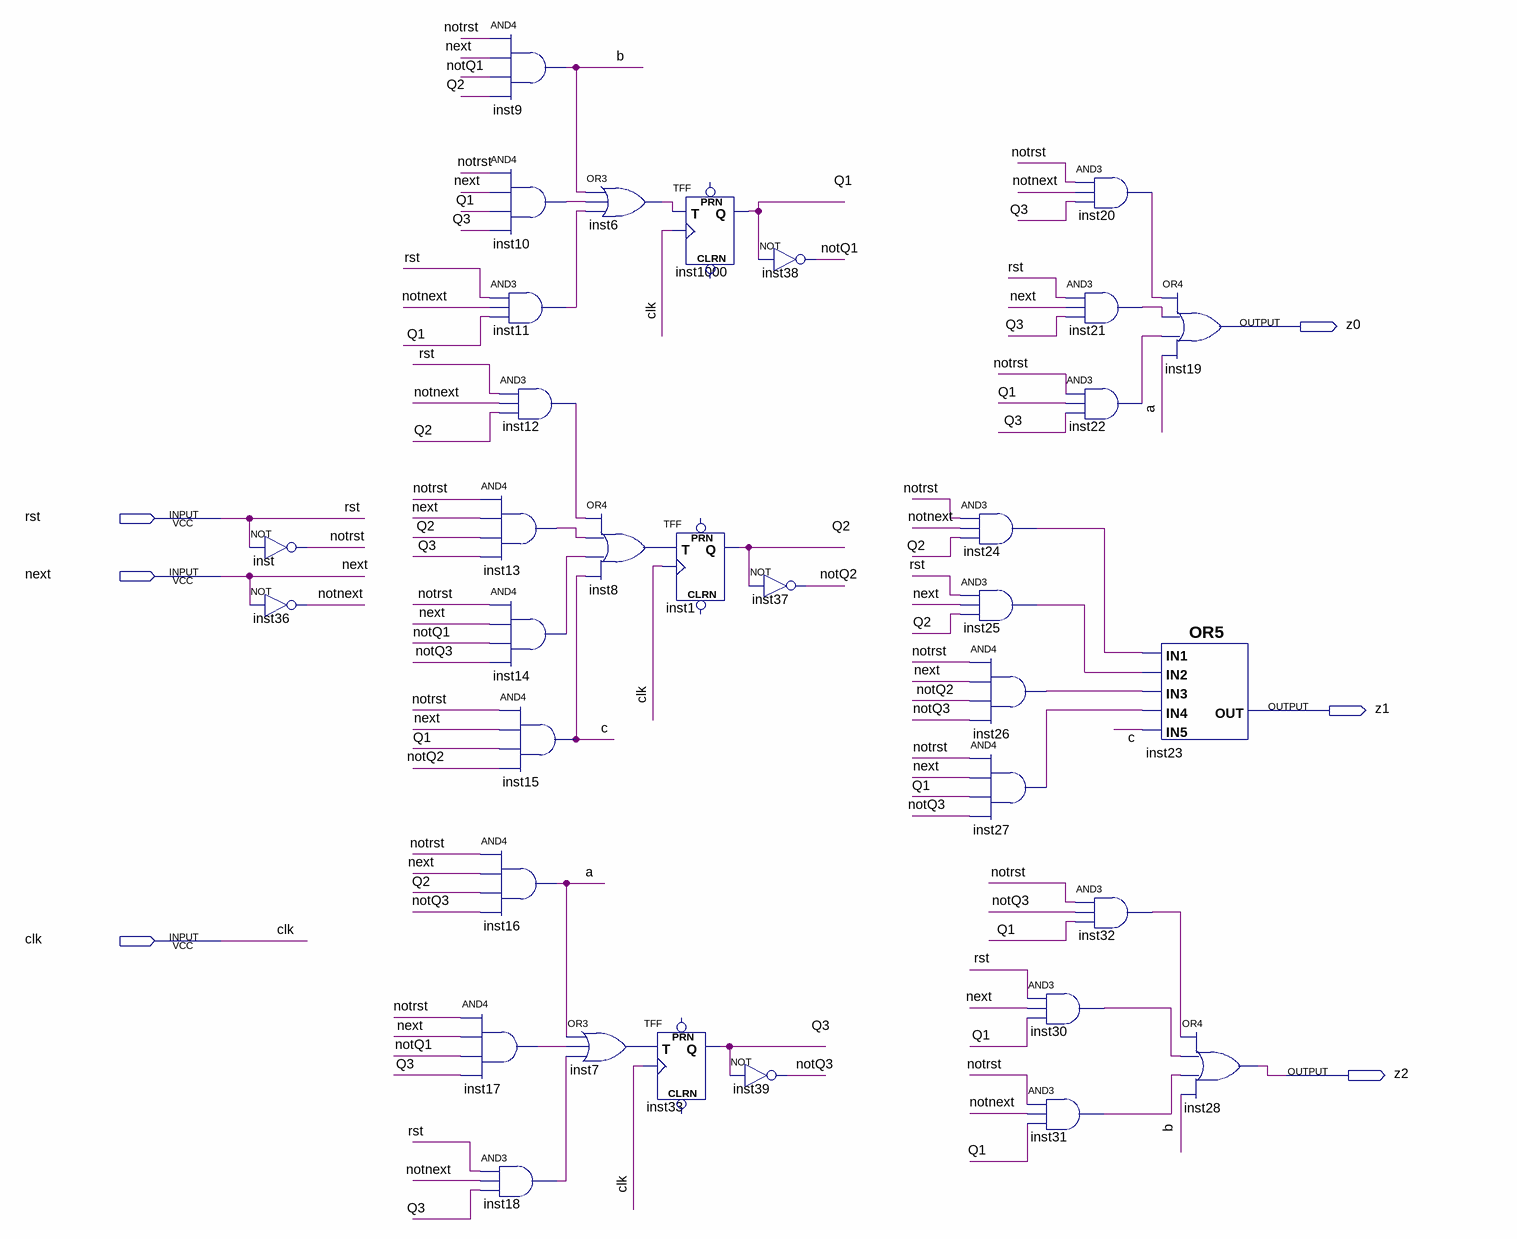
[diagram p0: schematic sheet]
// Quartus schematic PRandom07.bdf as structural Verilog: 34 symbols, 6 pins
module PRandom07 (
  input  rst,
  input  next,
  input  clk,
  output z0,
  output z1,
  output z2
);

  wire a, b, c, inst6_out, inst7_out, inst8_out, inst10_out, inst11_out, inst12_out, inst13_out, inst14_out,
       inst17_out, inst18_out, inst20_out, inst21_out, inst22_out, inst24_out, inst25_out, inst26_out,
       inst27_out, inst30_out, inst31_out, inst32_out, notnext, notQ1, notQ2, notQ3, notrst, Q1, Q2, Q3;

  not inst (notrst, rst);
  not inst36 (notnext, next);
  and inst9 (b, notrst, next, notQ1, Q2);
  and inst10 (inst10_out, notrst, next, Q1, Q3);
  and inst11 (inst11_out, rst, notnext, Q1);
  and inst12 (inst12_out, rst, notnext, Q2);
  and inst13 (inst13_out, notrst, next, Q2, Q3);
  and inst14 (inst14_out, notrst, next, notQ1, notQ3);
  and inst15 (c, notrst, next, Q1, notQ2);
  and inst16 (a, notrst, next, Q2, notQ3);
  and inst17 (inst17_out, notrst, next, notQ1, Q3);
  and inst18 (inst18_out, rst, notnext, Q3);
  or inst7 (inst7_out, a, inst17_out, inst18_out);
  or inst6 (inst6_out, b, inst10_out, inst11_out);
  or inst8 (inst8_out, inst12_out, inst13_out, inst14_out, c);
  TFF inst33 (.T(inst7_out), .CLK(clk), .Q(Q3));  // open: PRN, CLRN
  TFF inst1000 (.T(inst6_out), .CLK(clk), .Q(Q1));  // open: PRN, CLRN
  TFF inst1 (.T(inst8_out), .CLK(clk), .Q(Q2));  // open: PRN, CLRN
  not inst39 (notQ3, Q3);
  not inst38 (notQ1, Q1);
  not inst37 (notQ2, Q2);
  and inst24 (inst24_out, notrst, notnext, Q2);
  and inst25 (inst25_out, rst, next, Q2);
  and inst26 (inst26_out, notrst, next, notQ2, notQ3);
  and inst27 (inst27_out, notrst, next, Q1, notQ3);
  and inst30 (inst30_out, rst, next, Q1);
  and inst31 (inst31_out, notrst, notnext, Q1);
  and inst20 (inst20_out, notrst, notnext, Q3);
  and inst21 (inst21_out, rst, next, Q3);
  and inst22 (inst22_out, notrst, Q1, Q3);
  and inst32 (inst32_out, notrst, notQ3, Q1);
  or inst19 (z0, inst20_out, inst21_out, inst22_out, a);
  or inst23 (z1, inst24_out, inst25_out, inst26_out, inst27_out, c);
  or inst28 (z2, inst32_out, inst30_out, inst31_out, b);
endmodule
